# Altium schematic sheet Relay_Board_wiring.SchDoc
size A4
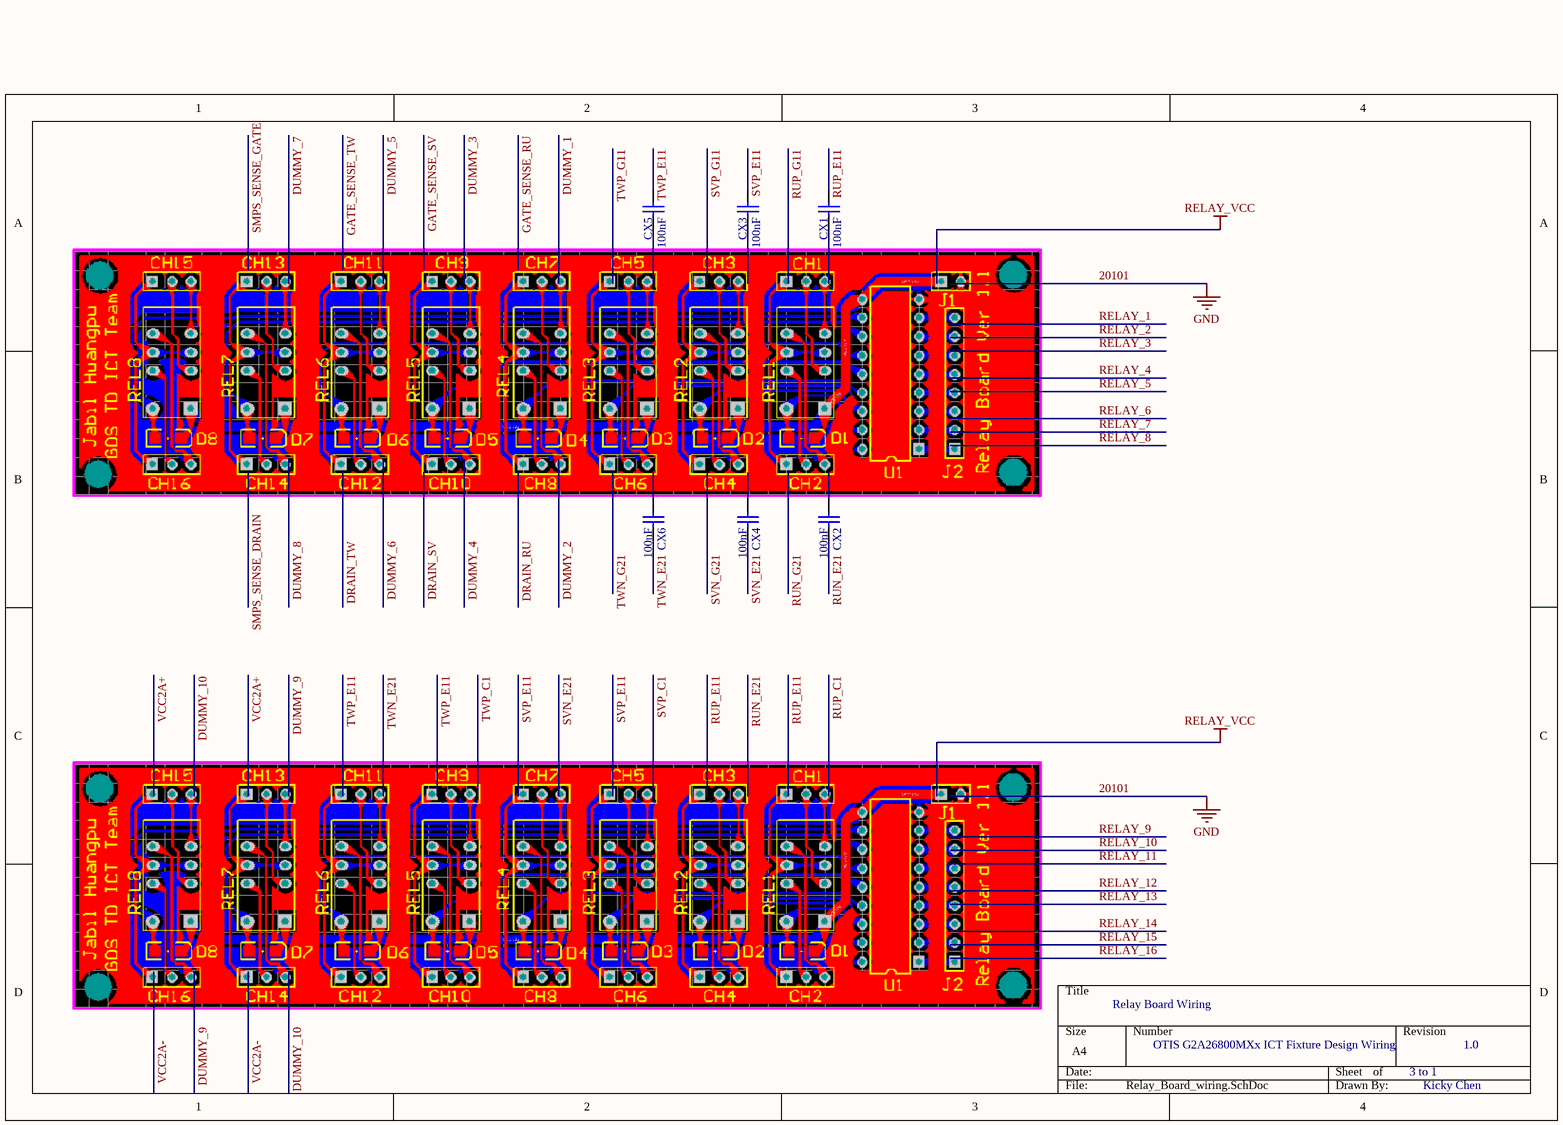
[diagram p0: Relay_Board_wiring.SchDoc]

## Parts
CX1  value 100nF  [1608[0603]]  (hidden comment: Cap Semi)
CX2  value 100nF  [1608[0603]]  (hidden comment: Cap Semi)
CX3  value 100nF  [1608[0603]]  (hidden comment: Cap Semi)
CX4  value 100nF  [1608[0603]]  (hidden comment: Cap Semi)
CX5  value 100nF  [1608[0603]]  (hidden comment: Cap Semi)
CX6  value 100nF  [1608[0603]]  (hidden comment: Cap Semi)

## Nets
RUN_E21: CX2.1
RUP_E11: CX1.2
SVN_E21: CX4.1
SVP_E11: CX3.2
TWN_E21: CX6.1
TWP_E11: CX5.2

Not connected (* = marked no-connect by the designer): CX1 1; CX2 2; CX3 1; CX4 2; CX5 1; CX6 2

## Notes on the sheet
- Relay Board Wiring
- OTIS G2A26800MXx ICT Fixture Design Wiring
- 3 to 1
- 1.0
- Kicky Chen
- Labels drawn without touching a wire or pin: SMPS_SENSE_GATE

## Library data of the parts
CX1-CX6 = Cap Semi: Capacitor (Semiconductor SIM Model); Published: 8-Jun-2000; LatestRevisionDate: 17-Jul-2002; LatestRevisionNote: Re-released for DXP Platform.; PackageReference: C1206; Publisher: Altium Limited